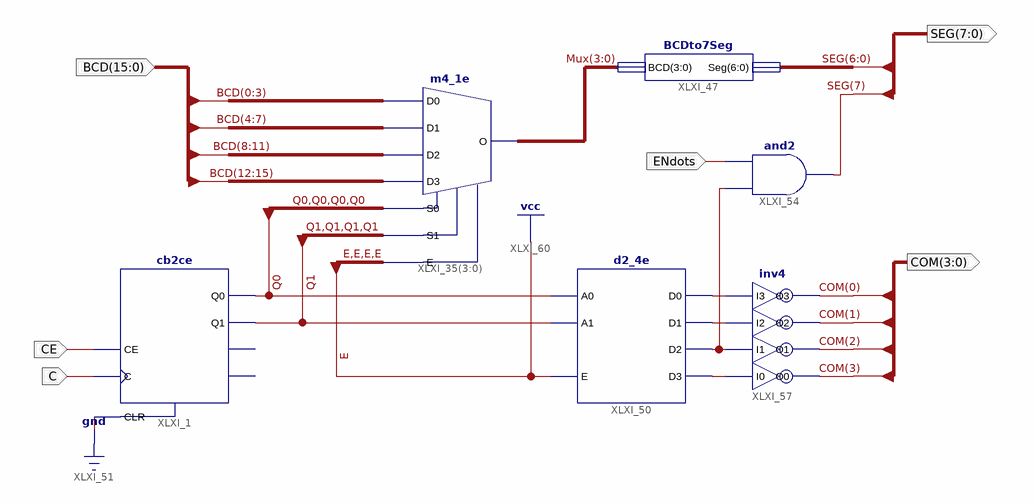
[diagram p0: schematic sheet 1]
// Xilinx ISE schematic BCDto7Seg4Digit.sch (spartan6) as structural Verilog: 6 symbols, 6 ports
module BCDto7Seg4Digit (
  input  [15:0] BCD,
  input  ENdots,
  input  CE,
  input  C,
  output [7:0] SEG,
  output [3:0] COM
);

  wire Q0, Q1, XLXN_184, XLXN_186, XLXN_188, XLXN_191;
  wire [3:0] Mux;

  m4_1e XLXI_35[3:0] (
    .D0({BCD[0], BCD[1], BCD[2], BCD[3]}), .D1({BCD[4], BCD[5], BCD[6], BCD[7]}),
    .D2({BCD[8], BCD[9], BCD[10], BCD[11]}), .D3({BCD[12], BCD[13], BCD[14], BCD[15]}), .E(4'b1111),
    .S0({4{Q0}}), .S1({4{Q1}}), .O(Mux));
  BCDto7Seg XLXI_47 (.BCD(Mux), .Seg(SEG[6:0]));
  cb2ce XLXI_1 (.C(C), .CE(CE), .CLR(1'b0), .Q0(Q0), .Q1(Q1));  // open: CEO, TC
  d2_4e XLXI_50 (.A0(Q0), .A1(Q1), .E(1'b1), .D0(XLXN_184), .D1(XLXN_191), .D2(XLXN_188), .D3(XLXN_186));
  inv4 XLXI_57 (
    .I0(XLXN_186), .I1(XLXN_188), .I2(XLXN_191), .I3(XLXN_184), .O0(COM[3]), .O1(COM[2]), .O2(COM[1]),
    .O3(COM[0]));
  and XLXI_54 (SEG[7], XLXN_188, ENdots);
endmodule
